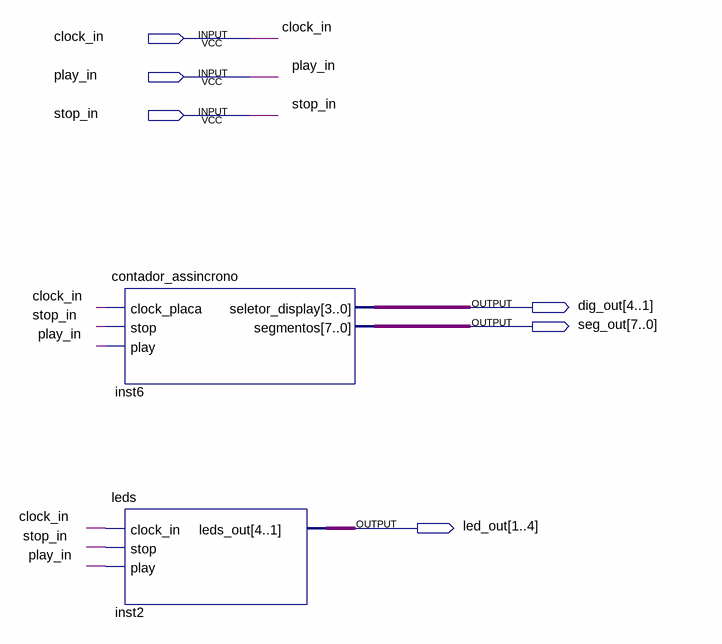
[diagram p0: schematic sheet]
// Quartus schematic bloco_displays_e_leds.bdf as structural Verilog: 2 symbols, 6 pins
module bloco_displays_e_leds (
  input  clock_in,
  input  play_in,
  input  stop_in,
  output [4:1] dig_out,
  output [7:0] seg_out,
  output [1:4] led_out
);

  contador_assincrono inst6 (
    .clock_placa(clock_in), .stop(stop_in), .play(play_in), .seletor_display(dig_out), .segmentos(seg_out));
  leds inst2 (.clock_in(clock_in), .stop(stop_in), .play(play_in), .leds_out(led_out));
endmodule
